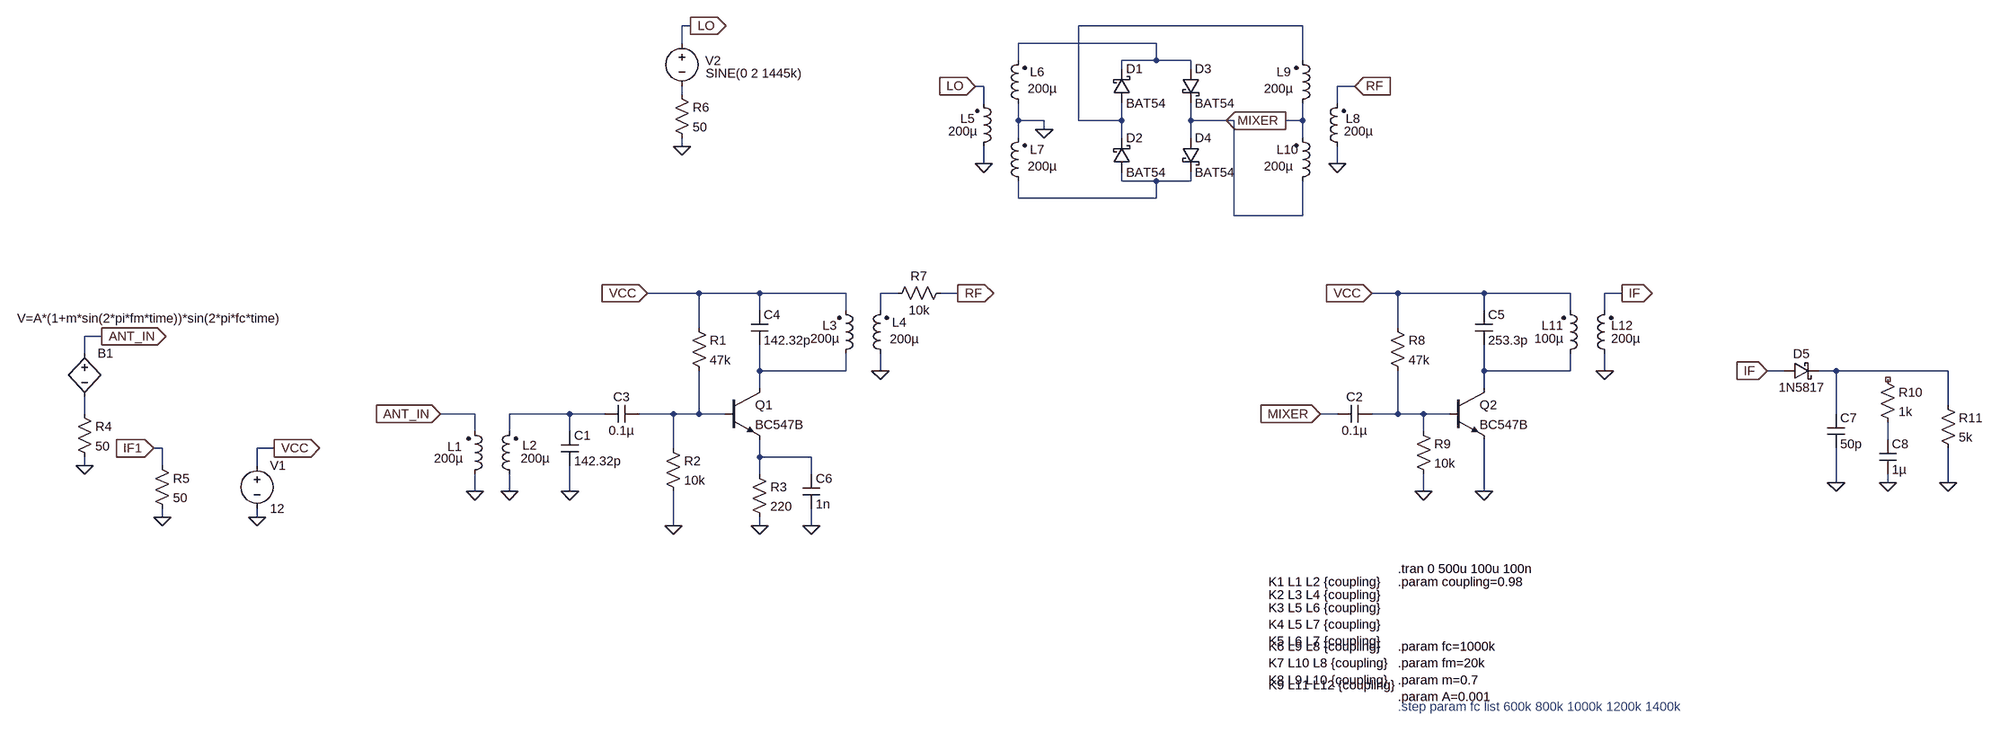
[diagram p0: schematic Draft1.asc]
Draft1.asc, the LTspice schematic file:
Version 4
SHEET 1 4052 1108
WIRE 736 -672 720 -672
WIRE 1872 -672 1456 -672
WIRE 720 -640 720 -672
WIRE 1600 -640 1344 -640
WIRE 1344 -608 1344 -640
WIRE 1600 -608 1600 -640
WIRE 1600 -608 1536 -608
WIRE 1664 -608 1600 -608
WIRE 1872 -608 1872 -672
WIRE 1536 -592 1536 -608
WIRE 1664 -592 1664 -608
WIRE 1280 -560 1264 -560
WIRE 1968 -560 1936 -560
WIRE 720 -544 720 -560
WIRE 1280 -528 1280 -560
WIRE 1936 -528 1936 -560
WIRE 1344 -496 1344 -528
WIRE 1392 -496 1344 -496
WIRE 1456 -496 1456 -672
WIRE 1536 -496 1536 -528
WIRE 1536 -496 1456 -496
WIRE 1664 -496 1664 -528
WIRE 1744 -496 1664 -496
WIRE 1872 -496 1872 -528
WIRE 1872 -496 1840 -496
WIRE 1392 -480 1392 -496
WIRE 1344 -464 1344 -496
WIRE 1536 -464 1536 -496
WIRE 1664 -464 1664 -496
WIRE 1872 -464 1872 -496
WIRE 720 -448 720 -464
WIRE 1280 -416 1280 -448
WIRE 1936 -416 1936 -448
WIRE 1536 -384 1536 -400
WIRE 1600 -384 1536 -384
WIRE 1664 -384 1664 -400
WIRE 1664 -384 1600 -384
WIRE 1344 -352 1344 -384
WIRE 1600 -352 1600 -384
WIRE 1600 -352 1344 -352
WIRE 1744 -320 1744 -496
WIRE 1872 -320 1872 -384
WIRE 1872 -320 1744 -320
WIRE 752 -144 656 -144
WIRE 864 -144 752 -144
WIRE 1024 -144 864 -144
WIRE 1120 -144 1088 -144
WIRE 1232 -144 1200 -144
WIRE 2048 -144 2000 -144
WIRE 2208 -144 2048 -144
WIRE 2368 -144 2208 -144
WIRE 2464 -144 2432 -144
WIRE 864 -112 864 -144
WIRE 1024 -112 1024 -144
WIRE 1088 -112 1088 -144
WIRE 2208 -112 2208 -144
WIRE 2368 -112 2368 -144
WIRE 2432 -112 2432 -144
WIRE 752 -80 752 -144
WIRE 2048 -80 2048 -144
WIRE -688 -64 -720 -64
WIRE -720 -32 -720 -64
WIRE 864 0 864 -48
WIRE 1024 0 1024 -32
WIRE 1024 0 864 0
WIRE 1088 0 1088 -32
WIRE 2208 0 2208 -48
WIRE 2368 0 2368 -32
WIRE 2368 0 2208 0
WIRE 2432 0 2432 -32
WIRE 3152 0 3120 0
WIRE 3248 0 3216 0
WIRE 3456 0 3248 0
WIRE 864 32 864 0
WIRE 2208 32 2208 0
WIRE 3456 64 3456 0
WIRE -720 80 -720 48
WIRE 336 80 272 80
WIRE 512 80 400 80
WIRE 576 80 512 80
WIRE 704 80 640 80
WIRE 752 80 752 0
WIRE 752 80 704 80
WIRE 800 80 752 80
WIRE 1936 80 1904 80
WIRE 2048 80 2048 0
WIRE 2048 80 2000 80
WIRE 2096 80 2048 80
WIRE 2144 80 2096 80
WIRE 3248 80 3248 0
WIRE 336 112 336 80
WIRE 400 112 400 80
WIRE 512 112 512 80
WIRE 2096 112 2096 80
WIRE 3344 128 3344 96
WIRE -576 144 -592 144
WIRE -368 144 -400 144
WIRE 704 144 704 80
WIRE 864 160 864 128
WIRE 960 160 864 160
WIRE -720 176 -720 160
WIRE -576 176 -576 144
WIRE -400 176 -400 144
WIRE 864 192 864 160
WIRE 960 192 960 160
WIRE 3248 208 3248 144
WIRE 3344 208 3344 192
WIRE 3456 208 3456 144
WIRE 336 224 336 192
WIRE 400 224 400 192
WIRE 512 224 512 176
WIRE 2096 224 2096 192
WIRE 2208 224 2208 128
WIRE -576 272 -576 256
WIRE -400 272 -400 256
WIRE 704 288 704 224
WIRE 864 288 864 272
WIRE 960 288 960 256
FLAG 336 224 0
FLAG 400 224 0
FLAG 512 224 0
FLAG 704 288 0
FLAG 864 288 0
FLAG 960 288 0
FLAG 1088 0 0
FLAG -720 176 0
FLAG -400 272 0
FLAG -368 144 VCC
IOPIN -368 144 Out
FLAG 656 -144 VCC
IOPIN 656 -144 In
FLAG -688 -64 ANT_IN
IOPIN -688 -64 Out
FLAG 272 80 ANT_IN
IOPIN 272 80 In
FLAG 1232 -144 RF
IOPIN 1232 -144 Out
FLAG 1392 -480 0
FLAG 1280 -416 0
FLAG 1264 -560 LO
IOPIN 1264 -560 In
FLAG 1936 -416 0
FLAG 1968 -560 RF
IOPIN 1968 -560 In
FLAG 1840 -496 MIXER
IOPIN 1840 -496 Out
FLAG -592 144 IF1
IOPIN -592 144 In
FLAG -576 272 0
FLAG 736 -672 LO
IOPIN 736 -672 Out
FLAG 720 -448 0
FLAG 2096 224 0
FLAG 2208 224 0
FLAG 2000 -144 VCC
IOPIN 2000 -144 In
FLAG 1904 80 MIXER
IOPIN 1904 80 In
FLAG 2432 0 0
FLAG 2464 -144 IF
IOPIN 2464 -144 Out
FLAG 3120 0 IF
IOPIN 3120 0 In
FLAG 3344 208 0
FLAG 3456 208 0
FLAG 3248 208 0
SYMBOL ind2 320 208 M180
WINDOW 0 -35 67 Left 2
WINDOW 3 -60 45 Left 2
SYMATTR InstName L1
SYMATTR Value 200µ
SYMATTR Type ind
SYMBOL ind2 416 208 R180
WINDOW 0 -35 69 Left 2
WINDOW 3 -59 45 Left 2
SYMATTR InstName L2
SYMATTR Value 200µ
SYMATTR Type ind
SYMBOL cap 496 112 R0
SYMATTR InstName C1
SYMATTR Value 142.32p
SYMBOL npn 800 32 R0
SYMATTR InstName Q1
SYMATTR Value BC547B
SYMBOL cap 640 64 R90
WINDOW 0 0 32 VBottom 2
WINDOW 3 32 32 VTop 2
SYMATTR InstName C3
SYMATTR Value 0.1µ
SYMBOL cap 848 -112 R0
SYMATTR InstName C4
SYMATTR Value 142.32p
SYMBOL ind2 1008 -16 M180
WINDOW 0 -27 68 Left 2
WINDOW 3 -50 44 Left 2
SYMATTR InstName L3
SYMATTR Value 200µ
SYMATTR Type ind
SYMBOL ind2 1104 -16 R180
WINDOW 0 -33 74 Left 2
WINDOW 3 -56 43 Left 2
SYMATTR InstName L4
SYMATTR Value 200µ
SYMATTR Type ind
SYMBOL res 736 -96 R0
SYMATTR InstName R1
SYMATTR Value 47k
SYMBOL res 688 128 R0
SYMATTR InstName R2
SYMATTR Value 10k
SYMBOL res 848 176 R0
SYMATTR InstName R3
SYMATTR Value 220
SYMBOL cap 944 192 R0
SYMATTR InstName C6
SYMATTR Value 1n
SYMBOL bv -720 -48 R0
WINDOW 3 -125 -49 Left 2
SYMATTR InstName B1
SYMATTR Value V=A*(1+m*sin(2*pi*fm*time))*sin(2*pi*fc*time)
SYMBOL voltage -400 160 R0
WINDOW 123 0 0 Left 0
WINDOW 39 0 0 Left 0
SYMATTR InstName V1
SYMATTR Value 12
SYMBOL res -736 64 R0
SYMATTR InstName R4
SYMATTR Value 50
SYMBOL ind2 1264 -432 M180
WINDOW 0 -27 68 Left 2
WINDOW 3 -50 44 Left 2
SYMATTR InstName L5
SYMATTR Value 200µ
SYMATTR Type ind
SYMBOL ind2 1360 -512 R180
WINDOW 0 -33 74 Left 2
WINDOW 3 -56 43 Left 2
SYMATTR InstName L6
SYMATTR Value 200µ
SYMATTR Type ind
SYMBOL ind2 1360 -368 R180
WINDOW 0 -33 74 Left 2
WINDOW 3 -56 43 Left 2
SYMATTR InstName L7
SYMATTR Value 200µ
SYMATTR Type ind
SYMBOL schottky 1520 -528 M180
WINDOW 0 24 64 Left 2
WINDOW 3 24 0 Left 2
SYMATTR InstName D1
SYMATTR Value BAT54
SYMATTR Description Diode
SYMATTR Type diode
SYMBOL schottky 1520 -400 M180
WINDOW 0 24 64 Left 2
WINDOW 3 24 0 Left 2
SYMATTR InstName D2
SYMATTR Value BAT54
SYMATTR Description Diode
SYMATTR Type diode
SYMBOL schottky 1648 -592 R0
SYMATTR InstName D3
SYMATTR Value BAT54
SYMATTR Description Diode
SYMATTR Type diode
SYMBOL schottky 1648 -464 R0
SYMATTR InstName D4
SYMATTR Value BAT54
SYMATTR Description Diode
SYMATTR Type diode
SYMBOL ind2 1952 -432 R180
WINDOW 0 -27 68 Left 2
WINDOW 3 -50 44 Left 2
SYMATTR InstName L8
SYMATTR Value 200µ
SYMATTR Type ind
SYMBOL ind2 1856 -512 M180
WINDOW 0 -33 74 Left 2
WINDOW 3 -56 43 Left 2
SYMATTR InstName L9
SYMATTR Value 200µ
SYMATTR Type ind
SYMBOL ind2 1856 -368 M180
WINDOW 0 -33 74 Left 2
WINDOW 3 -56 43 Left 2
SYMATTR InstName L10
SYMATTR Value 200µ
SYMATTR Type ind
SYMBOL res -592 160 R0
SYMATTR InstName R5
SYMATTR Value 50
SYMBOL res 704 -560 R0
SYMATTR InstName R6
SYMATTR Value 50
SYMBOL res 1216 -160 R90
WINDOW 0 0 56 VBottom 2
WINDOW 3 32 56 VTop 2
SYMATTR InstName R7
SYMATTR Value 10k
SYMBOL npn 2144 32 R0
SYMATTR InstName Q2
SYMATTR Value BC547B
SYMBOL cap 2000 64 R90
WINDOW 0 0 32 VBottom 2
WINDOW 3 32 32 VTop 2
SYMATTR InstName C2
SYMATTR Value 0.1µ
SYMBOL cap 2192 -112 R0
SYMATTR InstName C5
SYMATTR Value 253.3p
SYMBOL ind2 2352 -16 M180
WINDOW 0 -37 68 Left 2
WINDOW 3 -50 44 Left 2
SYMATTR InstName L11
SYMATTR Value 100µ
SYMATTR Type ind
SYMBOL res 2032 -96 R0
SYMATTR InstName R8
SYMATTR Value 47k
SYMBOL res 2080 96 R0
SYMATTR InstName R9
SYMATTR Value 10k
SYMBOL ind2 2448 -16 R180
WINDOW 0 -37 68 Left 2
WINDOW 3 -50 44 Left 2
SYMATTR InstName L12
SYMATTR Value 200µ
SYMATTR Type ind
SYMBOL voltage 720 -656 R0
WINDOW 0 43 49 Left 2
WINDOW 3 44 72 Left 2
WINDOW 123 0 0 Left 0
WINDOW 39 0 0 Left 0
SYMATTR InstName V2
SYMATTR Value SINE(0 2 1445k)
SYMBOL schottky 3152 -16 M90
WINDOW 0 0 32 VBottom 2
WINDOW 3 32 32 VTop 2
SYMATTR InstName D5
SYMATTR Value 1N5817
SYMATTR Description Diode
SYMATTR Type diode
SYMBOL cap 3232 80 R0
SYMATTR InstName C7
SYMATTR Value 50p
SYMBOL res 3328 0 R0
SYMATTR InstName R10
SYMATTR Value 1k
SYMBOL cap 3328 128 R0
SYMATTR InstName C8
SYMATTR Value 1µ
SYMBOL res 3440 48 R0
SYMATTR InstName R11
SYMATTR Value 5k
TEXT 2048 512 Left 2 !.param fc=1000k\n.param fm=20k\n.param m=0.7\n.param A=0.001
TEXT 2048 368 Left 2 !.tran 0 500u 100u 100n
TEXT 1808 392 Left 2 !K1 L1 L2 {coupling}
TEXT 1808 440 Left 2 !K3 L5 L6 {coupling}\nK4 L5 L7 {coupling}\nK5 L6 L7 {coupling}
TEXT 1808 512 Left 2 !K6 L9 L8 {coupling}\nK7 L10 L8 {coupling}\nK8 L9 L10 {coupling}
TEXT 2048 392 Left 2 !.param coupling=0.98
TEXT 1808 416 Left 2 !K2 L3 L4 {coupling}
TEXT 2048 624 Left 2 ;.step param fc list 600k 800k 1000k 1200k 1400k
TEXT 1808 584 Left 2 !K9 L11 L12 {coupling}

The netlist it stands for:
* Draft1.asc
L1 0 ANT_IN 200µ
L2 0 N011 200µ
C1 N011 0 142.32p
Q1 N007 N012 N015 0 BC547B
C3 N012 N011 0.1µ
C4 VCC N007 142.32p
L3 N007 VCC 200µ
L4 0 N006 200µ
R1 VCC N012 47k
R2 N012 0 10k
R3 N015 0 220
C6 N015 0 1n
B1 ANT_IN N010 V=A*(1+m*sin(2*pi*fm*time))*sin(2*pi*fc*time)
V1 VCC 0 12
R4 N010 0 50
L5 0 LO 200µ
L6 0 N002 200µ
L7 N005 0 200µ
D1 N001 N002 BAT54
D2 N005 N001 BAT54
D3 N002 N004 BAT54
D4 N004 N005 BAT54
L8 0 RF 200µ
L9 MIXER N001 200µ
L10 N004 MIXER 200µ
R5 IF1 0 50
R6 N003 0 50
R7 RF N006 10k
Q2 N008 N013 0 0 BC547B
C2 N013 MIXER 0.1µ
C5 VCC N008 253.3p
L11 N008 VCC 100µ
R8 VCC N013 47k
R9 N013 0 10k
L12 0 IF 200µ
V2 LO N003 SINE(0 2 1445k)
D5 IF N009 1N5817
C7 N009 0 50p
R10 NC_01 N014 1k
C8 N014 0 1µ
R11 N009 0 5k
.model D D
.lib standard.dio
.model NPN NPN
.model PNP PNP
.lib standard.bjt
.param fc=1000k
.param fm=20k
.param m=0.7
.param A=0.001
.tran 0 500u 100u 100n
K1 L1 L2 {coupling}
K3 L5 L6 {coupling}
K4 L5 L7 {coupling}
K5 L6 L7 {coupling}
K6 L9 L8 {coupling}
K7 L10 L8 {coupling}
K8 L9 L10 {coupling}
.param coupling=0.98
K2 L3 L4 {coupling}
* .step param fc list 600k 800k 1000k 1200k 1400k
K9 L11 L12 {coupling}
.backanno
.end